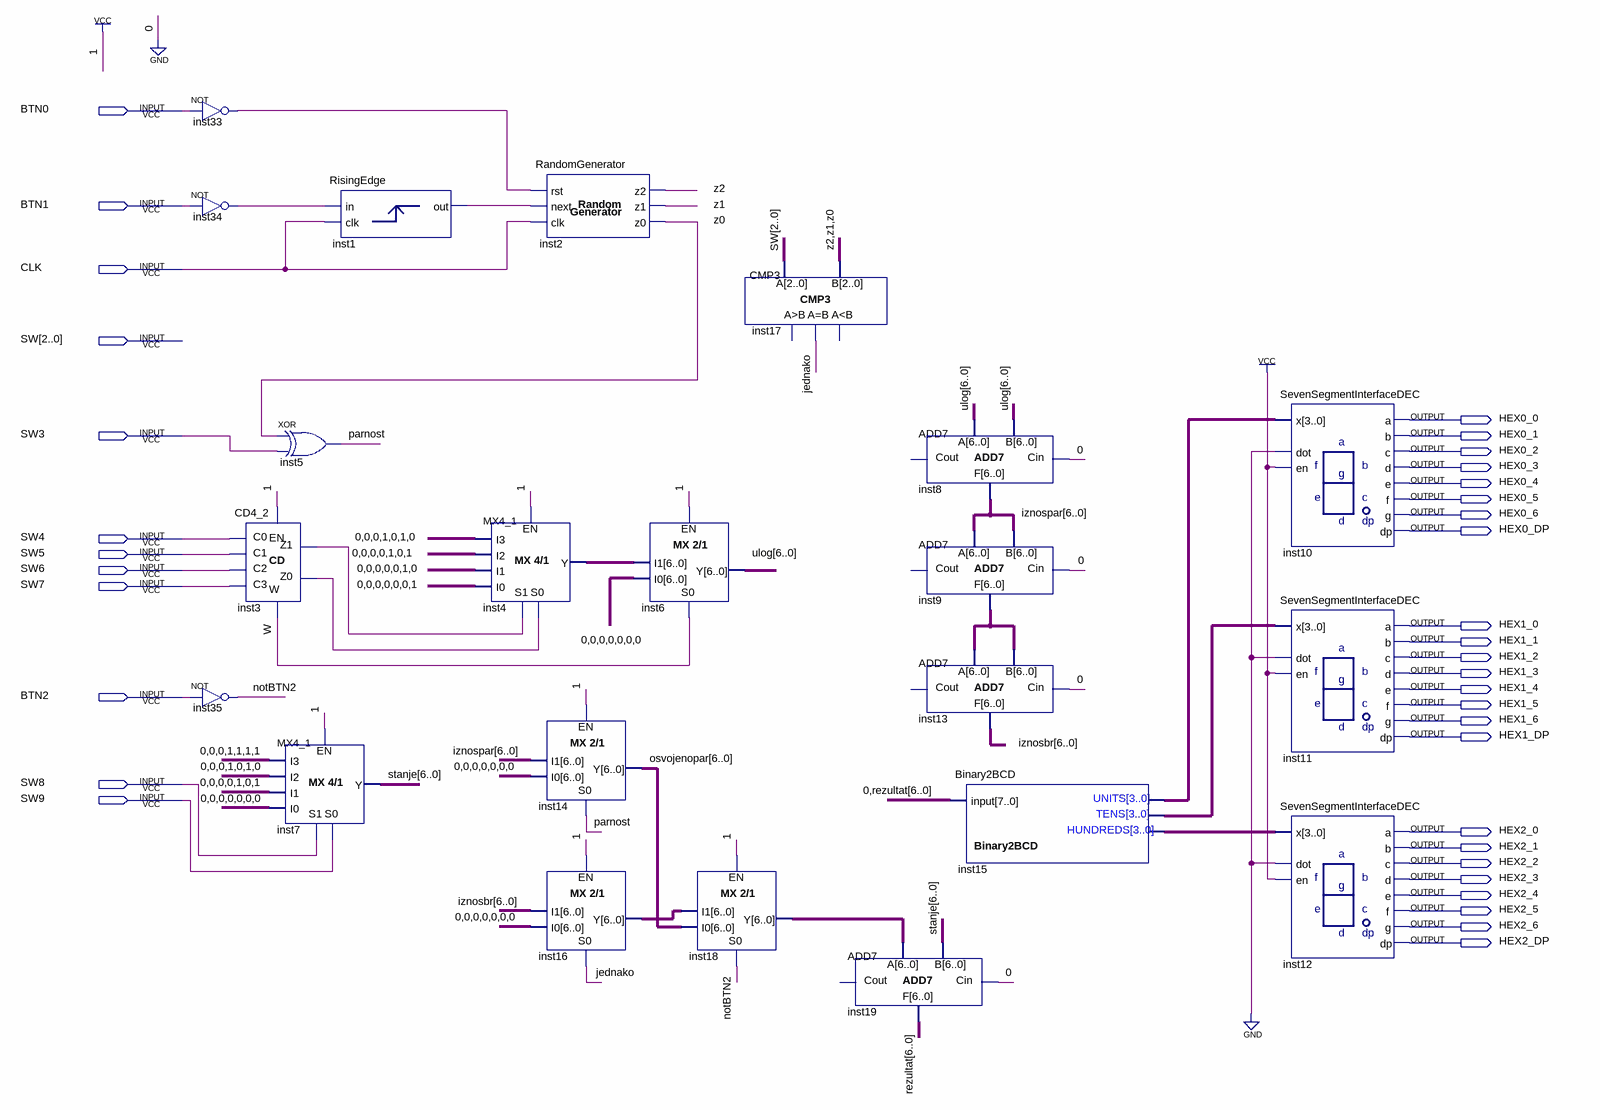
[diagram p0: schematic sheet]
// Quartus schematic PORT_LAB3.bdf as structural Verilog: 22 symbols, 36 pins
module PORT_LAB3 (
  input  BTN0,
  input  BTN1,
  input  CLK,
  input  [2:0] SW,
  input  SW3,
  input  SW4,
  input  SW5,
  input  SW6,
  input  SW7,
  input  BTN2,
  input  SW8,
  input  SW9,
  output HEX0_0,
  output HEX0_1,
  output HEX0_2,
  output HEX0_3,
  output HEX0_4,
  output HEX0_5,
  output HEX0_6,
  output HEX0_DP,
  output HEX1_0,
  output HEX1_1,
  output HEX1_2,
  output HEX1_3,
  output HEX1_4,
  output HEX1_5,
  output HEX1_6,
  output HEX1_DP,
  output HEX2_0,
  output HEX2_1,
  output HEX2_2,
  output HEX2_3,
  output HEX2_4,
  output HEX2_5,
  output HEX2_6,
  output HEX2_DP
);

  wire inst1_output, inst3_z0, inst3_z1, inst33_out, inst34_out, jednako, notBTN2, parnost, W, z0, z1, z2;
  wire [3:0] inst15_bcd_hundreds, inst15_bcd_tens, inst15_bcd_units;
  wire [6:0] inst4_y, inst9_f, inst16_y, inst18_y, iznosbr, iznospar, osvojenopar, rezultat, stanje, ulog;

  not inst33 (inst33_out, BTN0);
  not inst34 (inst34_out, BTN1);
  not inst35 (notBTN2, BTN2);
  CD4_2 inst3 (.C0(SW4), .C1(SW5), .C2(SW6), .C3(SW7), .EN(1'b1), .Z0(inst3_z0), .Z1(inst3_z1), .W(W));
  RisingEdge inst1 (.clk(CLK), .\input (inst34_out), .\output (inst1_output));
  xor inst5 (parnost, z0, SW3);
  MX4_1 inst7 (
    .S1(SW8), .S0(SW9), .EN(1'b1), .I3(7'b0001111), .I2(7'b0001010), .I1(7'b0000101), .I0({7{1'b0}}),
    .Y(stanje));
  MX4_1 inst4 (
    .S1(inst3_z1), .S0(inst3_z0), .EN(1'b1), .I3(7'b0001010), .I2(7'b0000101), .I1(7'b0000010),
    .I0(7'b0000001), .Y(inst4_y));
  RandomGenerator inst2 (.NXT(inst1_output), .RST(inst33_out), .CLK(CLK), .Z2(z2), .Z1(z1), .Z0(z0));
  MX2_1 inst14 (.S0(parnost), .EN(1'b1), .I0({7{1'b0}}), .I1(iznospar), .Y(osvojenopar));
  MX2_1 inst16 (.S0(jednako), .EN(1'b1), .I0({7{1'b0}}), .I1(iznosbr), .Y(inst16_y));
  MX2_1 inst6 (.S0(W), .EN(1'b1), .I0({7{1'b0}}), .I1(inst4_y), .Y(ulog));
  MX2_1 inst18 (.S0(notBTN2), .EN(1'b1), .I0(osvojenopar), .I1(inst16_y), .Y(inst18_y));
  CMP3 inst17 (.A(SW), .B({z2, z1, z0}), .AeqB(jednako));  // open: AgrB, AloB
  ADD7 inst19 (.Cin(1'b0), .A(inst18_y), .B(stanje), .F(rezultat));  // open: Cout
  ADD7 inst8 (.Cin(1'b0), .A(ulog), .B(ulog), .F(iznospar));  // open: Cout
  ADD7 inst9 (.Cin(1'b0), .A(iznospar), .B(iznospar), .F(inst9_f));  // open: Cout
  ADD7 inst13 (.Cin(1'b0), .A(inst9_f), .B(inst9_f), .F(iznosbr));  // open: Cout
  Binary2BCD inst15 (
    .\input ({1'b0, rezultat}), .bcd_hundreds(inst15_bcd_hundreds), .bcd_tens(inst15_bcd_tens),
    .bcd_units(inst15_bcd_units));
  SevenSegmentInterfaceDEC inst10 (
    .dot(1'b0), .en(1'b1), .x(inst15_bcd_units), .a(HEX0_0), .b(HEX0_1), .c(HEX0_2), .d(HEX0_3), .e(HEX0_4),
    .f(HEX0_5), .g(HEX0_6), .dp(HEX0_DP));
  SevenSegmentInterfaceDEC inst11 (
    .dot(1'b0), .en(1'b1), .x(inst15_bcd_tens), .a(HEX1_0), .b(HEX1_1), .c(HEX1_2), .d(HEX1_3), .e(HEX1_4),
    .f(HEX1_5), .g(HEX1_6), .dp(HEX1_DP));
  SevenSegmentInterfaceDEC inst12 (
    .dot(1'b0), .en(1'b1), .x(inst15_bcd_hundreds), .a(HEX2_0), .b(HEX2_1), .c(HEX2_2), .d(HEX2_3),
    .e(HEX2_4), .f(HEX2_5), .g(HEX2_6), .dp(HEX2_DP));
endmodule
